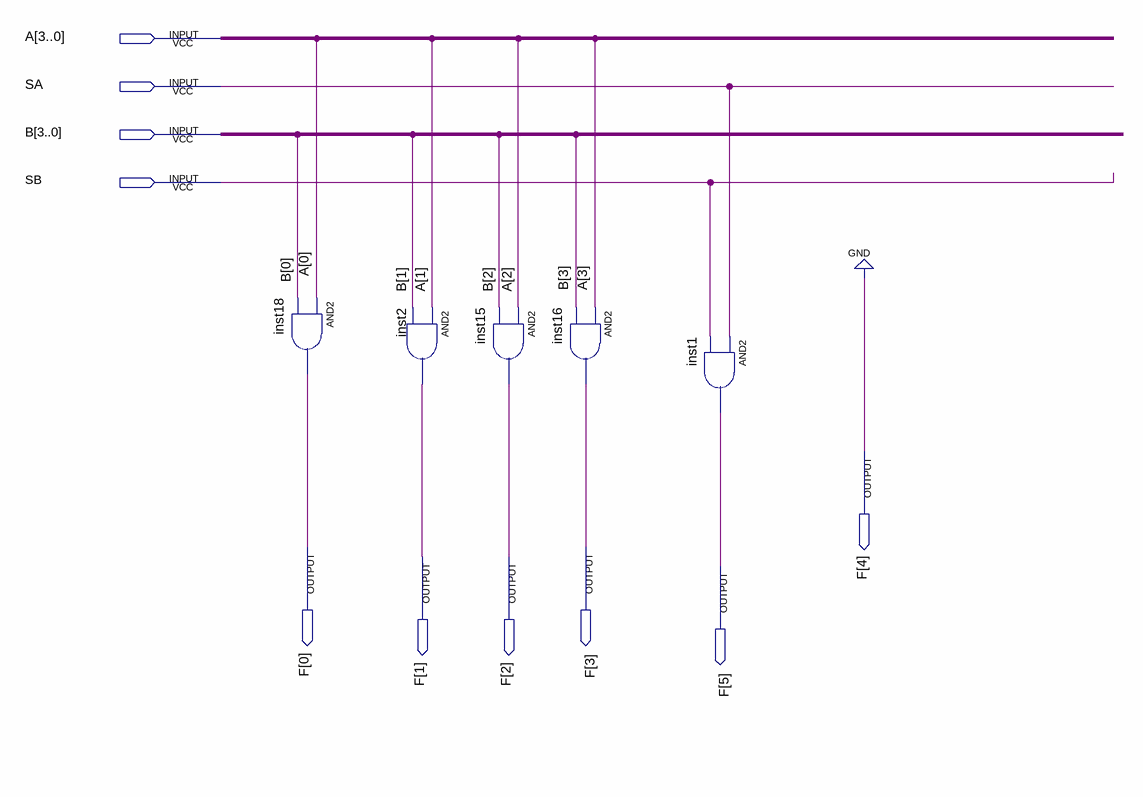
[diagram p0: schematic sheet]
// Quartus schematic op_and.bdf as structural Verilog: 5 symbols, 10 pins
module op_and (
  input  [3:0] A,
  input  SA,
  input  [3:0] B,
  input  SB,
  output [5:0] F
);

  and inst18 (F[0], A[0], B[0]);
  and inst2 (F[1], A[1], B[1]);
  and inst15 (F[2], A[2], B[2]);
  and inst16 (F[3], A[3], B[3]);
  and inst1 (F[5], SA, SB);

  assign F[4] = 1'b0;
endmodule
